# EAGLE design HW4 (EAGLE 9.6.2)
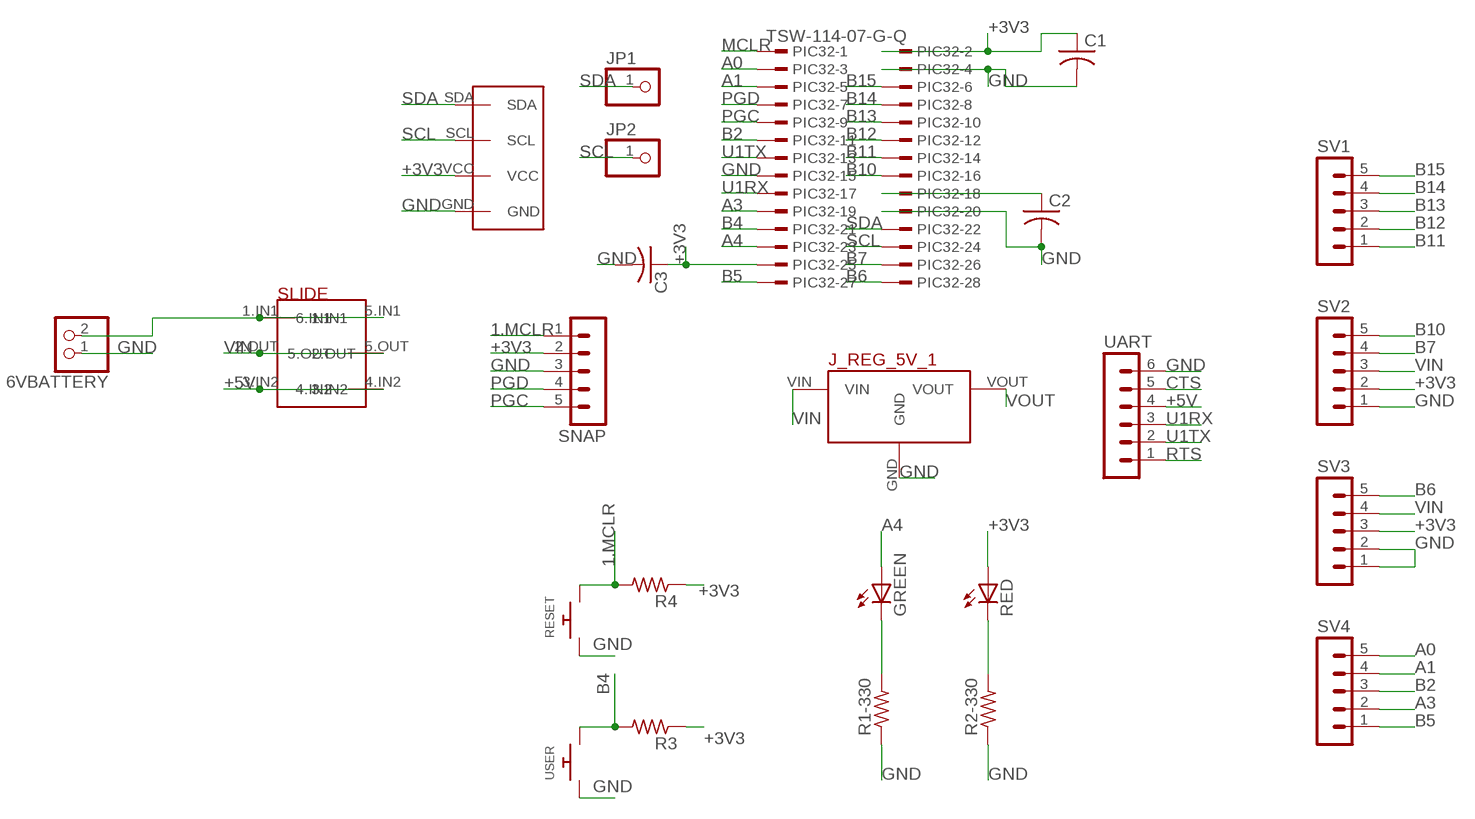
[diagram p0: schematic, sheet 1]

## Parts
6VBATTERY  PINHD-1X2  [1X02]
C1  C-US025-025X050  [C025-025X050]
C2  C-US025-025X050  [C025-025X050]
C3  C-US025-025X050  [C025-025X050]
GREEN  LED3MM  [LED3MM]
J_REG_5V_1  5V_VOLTAGE_REGULATOR  [5V_VOLTAGE_REGULATOR]
JP1  PINHD-1X1  [1X01]
JP2  PINHD-1X1  [1X01]
PIC32  TSW-114-07-G-Q  [TSW-114-XX-G-Q]
R1-330  R-US_0204/7  [0204/7]
R2-330  R-US_0204/7  [0204/7]
R3  R-US_0204/7  [0204/7]
R4  R-US_0204/7  [0204/7]
RED  LED3MM  [LED3MM]
RESET  SWITCH_PUSHBUTTONSOFTTOUCHSMD_SJ  [PUSHBUTTON_SMD_SJ]
SLIDE  SLIDE_DEVICE  [SLIDE_FOOTPRINT]
SNAP  MA05-1  [MA05-1]
SV1  MA05-1  [MA05-1]
SV2  MA05-1  [MA05-1]
SV3  MA05-1  [MA05-1]
SV4  MA05-1  [MA05-1]
U$1  SSD1306_DEVICE  [SSD1306_FOOTPRINT]
UART  MA06-1  [MA06-1]
USER  SWITCH_PUSHBUTTONSOFTTOUCHSMD_SJ  [PUSHBUTTON_SMD_SJ]

## Nets
1.MCLR: R4.2 RESET.P$2 SNAP.1
+3V3: C1.1 C3.1 PIC32.2 PIC32.25 R3.1 R4.1 RED.A SNAP.2 SV2.2 SV3.3 U$1.VCC
+5V: SLIDE.3.IN2 SLIDE.4.IN2 UART.4
A0: PIC32.3 SV4.5
A1: PIC32.5 SV4.4
A3: PIC32.19 SV4.2
A4: GREEN.A PIC32.23
B2: PIC32.11 SV4.3
B4: PIC32.21 R3.2 USER.P$2
B5: PIC32.27 SV4.1
B6: PIC32.28 SV3.5
B7: PIC32.26 SV2.4
B10: PIC32.16 SV2.5
B11: PIC32.14 SV1.1
B12: PIC32.12 SV1.2
B13: PIC32.10 SV1.3
B14: PIC32.8 SV1.4
B15: PIC32.6 SV1.5
CTS: UART.5
GND: 6VBATTERY.1 C1.2 C2.2 C3.2 J_REG_5V_1.GND PIC32.4 PIC32.15 PIC32.20 R1-330.1 R2-330.1 RESET.P$1 SNAP.3 SV2.1 SV3.1 SV3.2 U$1.GND UART.6 USER.P$1
MCLR: PIC32.1
N$1: 6VBATTERY.2 SLIDE.1.IN1 SLIDE.5.IN1(6.IN1)
N$21: GREEN.K(C) R1-330.2
N$22: R2-330.2 RED.K(C)
N$25: C2.1 PIC32.18
PGC: PIC32.9 SNAP.5
PGD: PIC32.7 SNAP.4
RTS: UART.1
SCL: JP2.1 PIC32.24 U$1.SCL
SDA: JP1.1 PIC32.22 U$1.SDA
U1RX: PIC32.17 UART.3
U1TX: PIC32.13 UART.2
VIN: J_REG_5V_1.VIN SLIDE.2.OUT SLIDE.5.OUT SV2.3 SV3.4
VOUT: J_REG_5V_1.VOUT

## Library data of the parts
6VBATTERY = pinhead:PINHD-1X2: PIN HEADER
C1-C3 = adafruit:C-US: CAPACITOR, American symbol
GREEN RED = adafruit:LED: LED OSRAM: - CHIPLED LG R971, LG N971, LY N971, LG Q971, LY Q971, LO R971, LY R971 LH N974, LH R974 LS Q976, LO Q976, LY Q976 LO Q996 - Hyper CHIPLED LW Q18S LB Q993, LB Q99A, LB R99A - SideLED LS A670, LO A670, LY A670, LG A670, LP A670 LB A673, LV A673, LT A673, LW A673 LH A674 LY A675 LS A676, LA A676, LO A676, LY A676, LW A676 LS A679, LY A679, LG A679 - Hyper Micro SIDELED® LS Y876, LA Y876, LO Y876, LY Y876 LT Y87S - SmartLED LW L88C, LW L88S LB L89C, LB L89S, LG L890 LS L89K, LO L89K, LY L89K LS L896, LA L896, LO L896, LY L896 - TOPLED LS T670, LO T670, LY T670, LG T670, LP T670 LSG T670, LSP T670, LSY T670, LOP T670, LYG T670 LG T671, LOG T671, LSG T671 LB T673, LV T673, LT T673, LW T673 LH T674 LS T676, LA T676, LO T676, LY T676, LB T676, LH T676, LSB T676, LW T676 LB T67C, LV T67C, LT T67C, LS T67K, LO T67K, LY T67K, LW E67C LS E67B, LA E67B, LO E67B, LY E67B, LB E67C, LV E67C, LT E67C LW T67C LS T679, LY T679, LG T679 LS T770, LO T770, LY T770, LG T770, LP T770 LB T773, LV T773, LT T773, LW T773 LH T774 LS E675, LA E675, LY E675, LS T675 LS T776, LA T776, LO T776, LY T776, LB T776 LHGB T686 LT T68C, LB T68C - Hyper Mini TOPLED® LB M676 - Mini TOPLED Santana® LG M470 LS M47K, LO M47K, LY M47K Source: http://www.osram.convergy.de/
J_REG_5V_1 = pololu:5V_VOLTAGE_REGULATOR: Polulu 5V Step-Up/Step-Down Voltage REgulator S7V7F5
JP1 JP2 = adafruit:PINHD-1X1: Pin header 1x1 for 0.1" spacing With round pins
PIC32 = con-samtec:TSW-114-*-G: THROUGH-HOLE .025" SQ POST HEADER Source: Samtec TSW.pdf; MF: Samtec Inc.; MPN: TSW-114-07-G-Q
R1-330 R2-330 R3 R4 = adafruit:R-US_: RESISTOR, American symbol
RESET USER = adafruit:SWITCH_PUSHBUTTON: Buttons SOFTTOUCHSMD_SJ - Soft touch temporary push button (Super Junk Akihabara) Compatible with SKPMANE010 [Mouser: 688-SKPMAN] C&K_KSS = Digikey: KSS221GLFS
SLIDE = SLIDE:SLIDE_DEVICE
SNAP SV1-SV4 = con-lstb:MA05-1: PIN HEADER; OC_FARNELL: unknown; OC_NEWARK: unknown
U$1 = SSD1306:SSD1306_DEVICE
UART = con-lstb:MA06-1: PIN HEADER; OC_FARNELL: unknown; OC_NEWARK: unknown

## Board
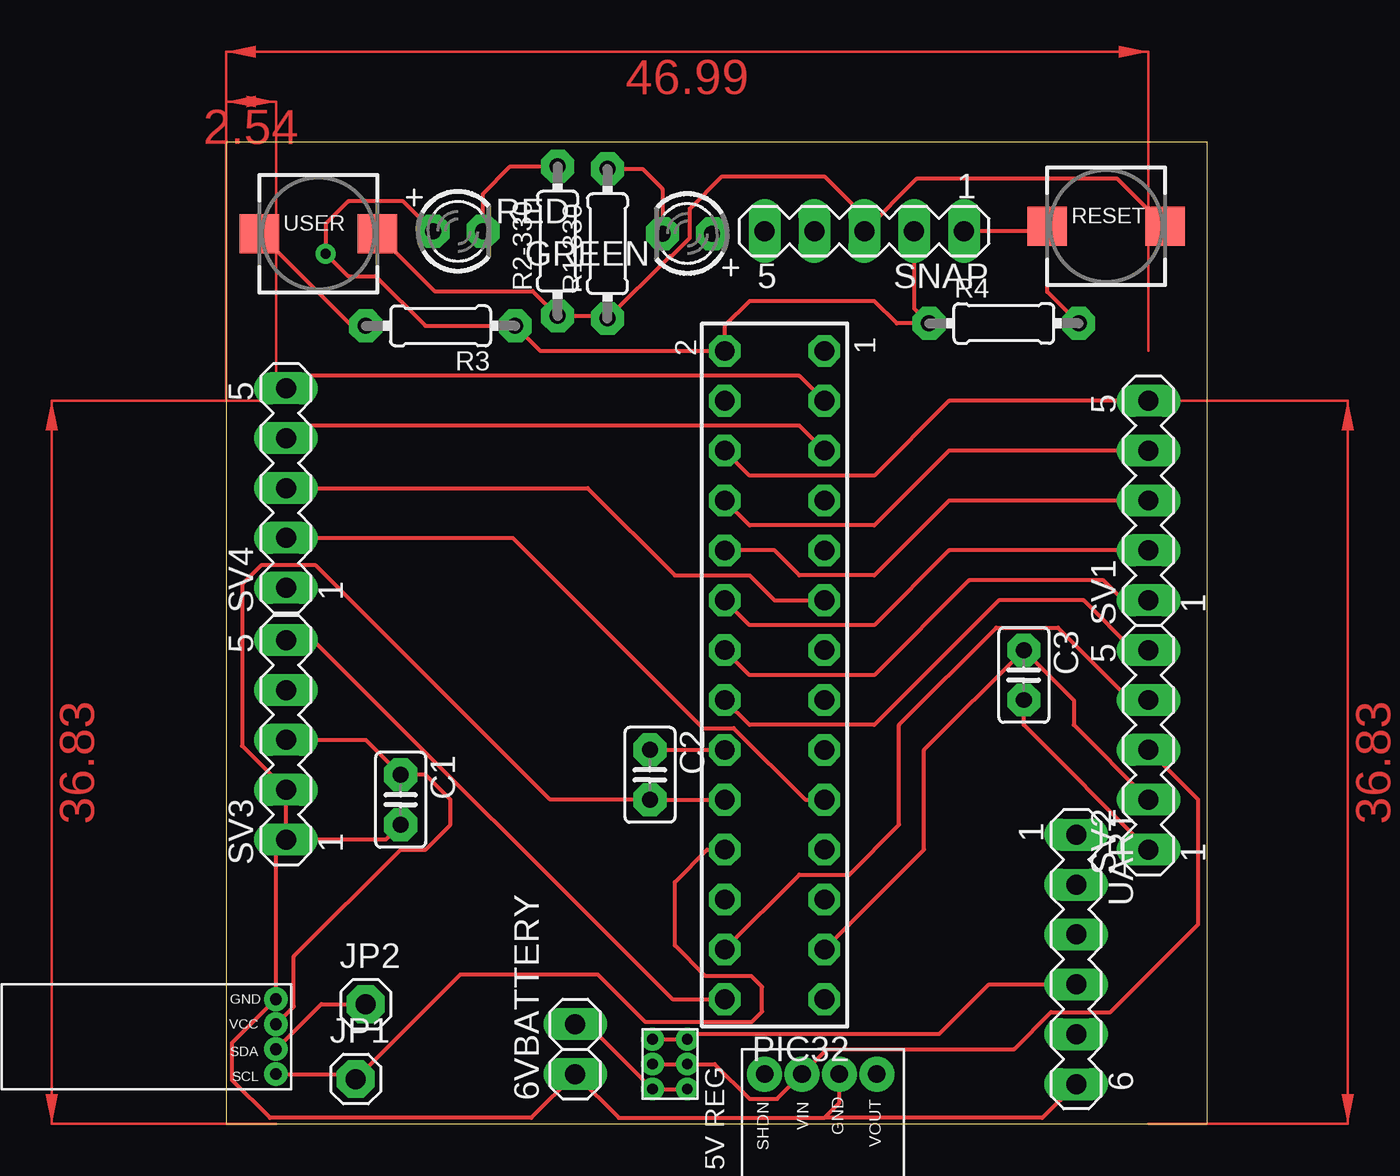
[diagram p1: board, top side]
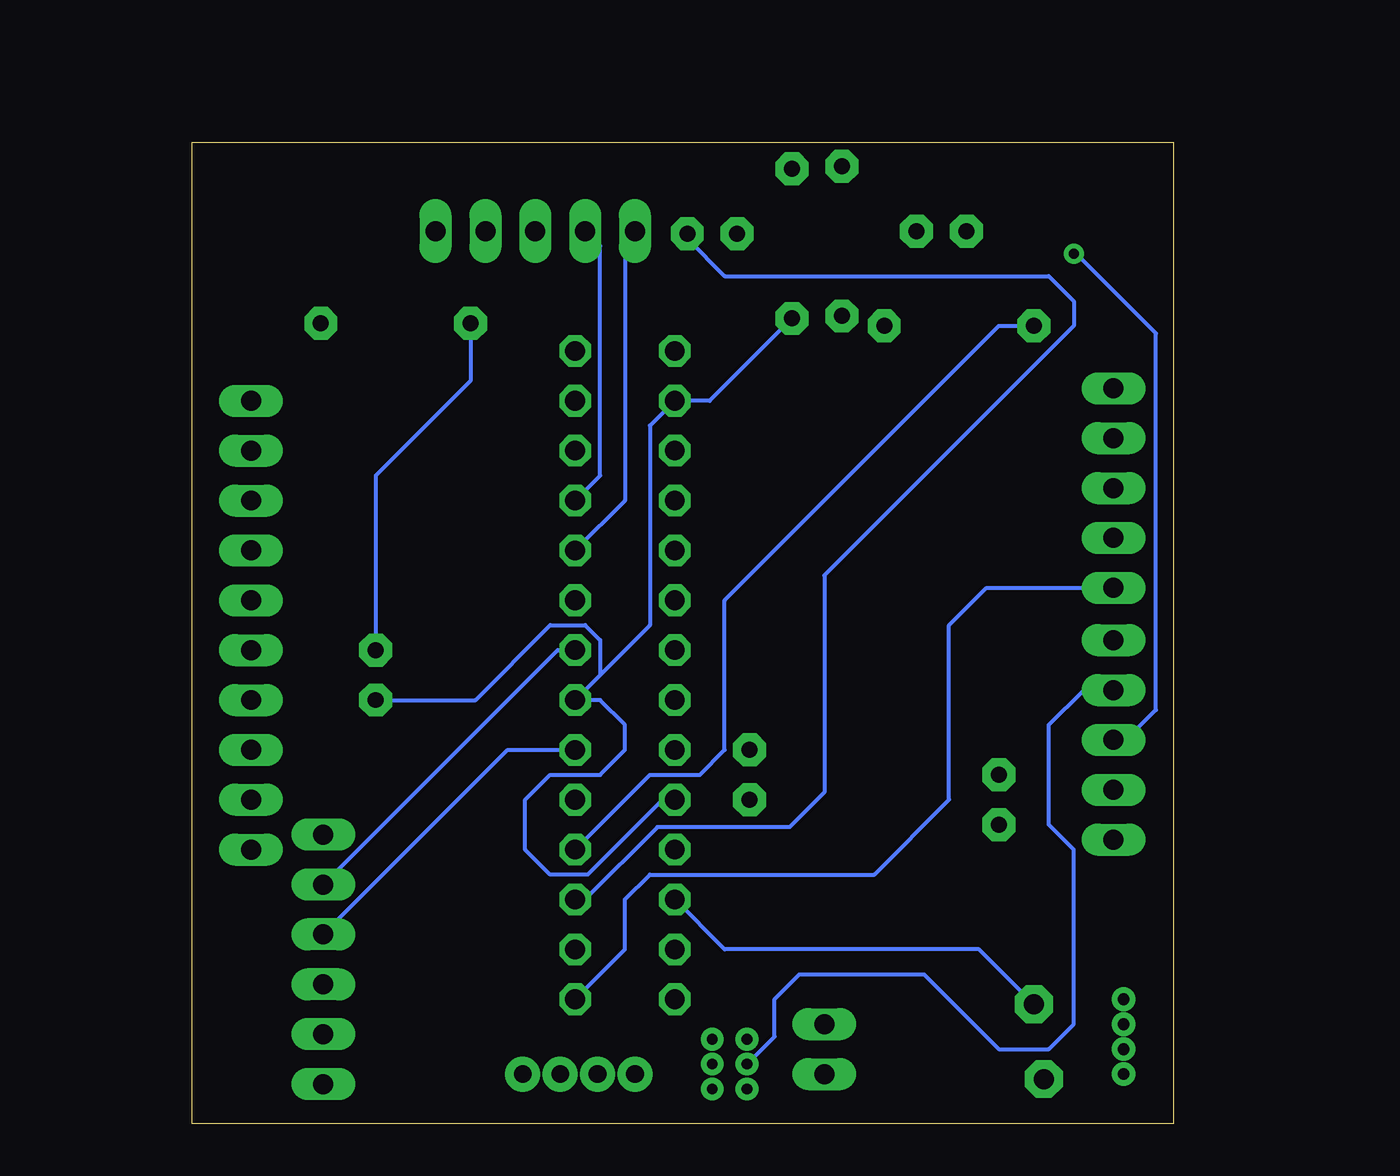
[diagram p2: board, bottom side, seen from below]

Size 50 x 50 mm. Coordinates in mm from the lower left corner, seen from the top.
Outline: 0,0 50,0 50,50 0,50 0,0
Copper layers (1*16): Top 0.035mm / dielectric 1.5mm / Bottom 0.035mm
Design rules "SparkFun": minimum track width 8mil, minimum drill 20mil, track to track 8mil, track to pad 8mil, pad to pad 8mil, via to via 8mil, smd to smd 8mil, copper to edge 8mil, drill to drill 8mil, minimum pad ring 12mil, minimum via ring 10mil, stop-mask expansion 4mil, vias tented up to drill 20mil, thermal gap 10mil

### Footprints (pad centres in the part's own frame; a part is rotated, then mirrored left to right if it is on the bottom)
1X02 = drill 1.016 long: 1 -1.27,0; 2 1.27,0
C025-025X050 = drill 0.813 pad 1.676 octagon: 1 -1.27,0; 2 1.27,0
LED3MM = drill 0.813 pad 1.676 octagon: A -1.27,0; K 1.27,0
5V_VOLTAGE_REGULATOR = drill 0.9 pad 1.778: GND 2.54,-3.048; SHDN 2.54,0.762; VIN 2.54,-1.143; VOUT 2.54,-4.953
1X01 = drill 1.016 pad 1.93 octagon: 1 0,0
TSW-114-XX-G-Q = drill 1 pad 1.5 octagon: 1 16.51,-2.54; 2 16.51,2.54; 3 13.97,-2.54; 4 13.97,2.54; 5 11.43,-2.54; 6 11.43,2.54; 7 8.89,-2.54; 8 8.89,2.54; 9 6.35,-2.54; 10 6.35,2.54; 11 3.81,-2.54; 12 3.81,2.54; 13 1.27,-2.54; 14 1.27,2.54; 15 -1.27,-2.54; 16 -1.27,2.54; 17 -3.81,-2.54; 18 -3.81,2.54; 19 -6.35,-2.54; 20 -6.35,2.54; 21 -8.89,-2.54; 22 -8.89,2.54; 23 -11.43,-2.54; 24 -11.43,2.54; 25 -13.97,-2.54; 26 -13.97,2.54; 27 -16.51,-2.54; 28 -16.51,2.54
0204/7 = drill 0.813 pad 1.676 octagon: 1 -3.81,0; 2 3.81,0
PUSHBUTTON_SMD_SJ = smd 2 x 2: P$1 3,0; P$2 -3,0
SLIDE_FOOTPRINT = drill 0.55 pad 0.813: 1.IN1 -1.27,-2.54; 2.OUT -1.27,-1.27; 3.IN2 -1.27,0; 4.IN2 0.508,0; 5.IN1 0.508,-2.54; 5.OUT 0.508,-1.27
MA05-1 = drill 1.016 long: 1 -5.08,0; 2 -2.54,0; 3 0,0; 4 2.54,0; 5 5.08,0
SSD1306_FOOTPRINT = drill 0.6: GND -2.54,-3.81; SCL -2.54,-1.27; SDA -2.54,0; VCC -2.54,-2.54
MA06-1 = drill 1.016 long: 1 -6.35,0; 2 -3.81,0; 3 -1.27,0; 4 1.27,0; 5 3.81,0; 6 6.35,0

### Placement (x,y rotation side)
6VBATTERY  17.78,3.81 90 top
C1  8.89,16.51 270 top
C2  21.59,17.78 270 top
C3  40.64,22.86 270 top
GREEN  23.5,45.34 180 top
J_REG_5V_1  28.19,0 90 top
JP1  6.6,2.29 0 top
JP2  7.11,6.1 0 top
PIC32  27.94,22.86 90 top
R1-330  19.43,44.83 90 top
R2-330  16.89,44.96 90 top
R3  10.92,40.64 180 top
R4  39.62,40.77 0 top
RED  11.81,45.47 0 top
RESET  44.83,45.72 0 top
SLIDE  22.99,4.32 0 top
SNAP  32.51,45.47 180 top
SV1  46.99,31.75 90 top
SV2  46.99,19.05 90 top
SV3  3.05,19.56 90 top
SV4  3.05,32.38 90 top
U$1  0,2.54 180 top
UART  43.31,8.38 270 top
USER  4.7,45.34 0 top

### Tracks (layer width: path | path; a pad name or v marks a point on that pad's centre or on a via)
1.MCLR
  Top 0.203: R4.2 41.83,42.37 RESET.P$2 41.58,45.47 SNAP.1
+3V3  (via drill 0.51)
  Top 0.203: RED.A 9.02,46.99 6.22,46.99 5.08,45.85 v5.08,44.32 6.22,43.18 7.62,43.18 10.16,40.64 R3.1 16,39.37 PIC32.2 25.4,40.64 26.67,41.91 33.02,41.91 34.16,40.77 R4.1 35.05,41.53 SNAP.2 | U$1.VCC 2.9,5.44 2.92,5.44 3.45,5.97 3.45,8.53 8.89,13.97 10.16,13.97 11.43,15.24 11.43,16.51 10.16,17.78 C1.1 7.11,19.56 SV3.3 | SV2.2 43.18,20.32 43.18,21.59 C3.1 35.56,19.05 35.56,13.97 PIC32.25
  Bottom 0.203: SV3.3 2.41,19.56 0.89,21.08 0.89,40.26 4.95,44.32 v5.08,44.32 | R4.1 35.81,37.85 40.64,33.02 C3.1
+5V
  Top 0.203: SLIDE.3.IN2 SLIDE.4.IN2 23.75,4.57 36.32,4.57 38.86,7.11 UART.4
A0
  Top 0.203: SV4.5 3.68,38.1 29.21,38.1 PIC32.3
A1
  Top 0.203: SV4.4 3.68,35.56 29.21,35.56 PIC32.5
A3
  Top 0.203: SV4.2 14.61,29.84 24.29,20.16 25.86,20.16 29.51,16.51 PIC32.19
A4
  Bottom 0.203: PIC32.23 29.97,11.43 26.29,15.11 19.56,15.11 17.78,16.89 17.78,27.94 5.08,40.64 5.08,41.91 6.35,43.18 22.86,43.18 24.77,45.09 GREEN.A
B2
  Top 0.203: SV4.3 18.41,32.38 22.86,27.94 26.67,27.94 27.94,26.67 PIC32.11
B4
  Top 0.203: USER.P$2 6.4,40.64 R3.2
  Bottom 0.203: PIC32.21 26.67,17.78 24.13,17.78 22.86,19.05 22.86,26.67 8.89,40.64 R3.2
B5
  Bottom 0.203: PIC32.27 27.94,8.89 27.94,11.43 26.67,12.7 15.24,12.7 11.43,16.51 11.43,25.4 9.53,27.3 SV4.1
B6
  Top 0.203: SV3.5 4.45,24.64 22.73,6.35 PIC32.28
B7
  Top 0.203: PIC32.26 29.21,12.7 31.75,12.7 34.29,15.24 34.29,20.32 39.24,25.27 42.38,25.27 46.07,21.59 SV2.4
B10
  Top 0.203: PIC32.16 26.67,20.32 33.02,20.32 39.37,26.67 43.69,26.67 46.23,24.13 SV2.5
B11
  Top 0.203: SV1.1 45.72,26.67 44.7,27.69 37.85,27.69 33.02,22.86 26.67,22.86 PIC32.14
B12
  Top 0.203: SV1.2 36.83,29.21 33.02,25.4 26.67,25.4 PIC32.12
B13
  Top 0.203: SV1.3 36.83,31.75 33.02,27.94 29.21,27.94 27.94,29.21 PIC32.10
B14
  Top 0.203: SV1.4 36.83,34.29 33.02,30.48 26.67,30.48 PIC32.8
B15
  Top 0.203: SV1.5 36.83,36.83 33.02,33.02 26.67,33.02 PIC32.6
GND
  Top 0.203: USER.P$1 10.62,42.42 15.62,42.42 R2-330.1 19.3,41.15 R1-330.1 22.61,44.2 22.7,44.2 23.62,45.12 23.62,46.61 25.27,48.26 30.48,48.26 32.51,46.23 SNAP.3 35.18,48.13 45.42,48.13 RESET.P$1 | SV3.1 2.54,13.97 U$1.GND 2.18,5.99 2.16,5.99 0.3,4.13 0.3,2.23 2.23,0.3 15.54,0.3 6VBATTERY.1 20.02,0.3 30.48,0.3 | SV3.1 SV3.2 0.81,19.25 0.81,27.48 1.78,28.45 4.57,28.45 16.51,16.51 C2.2 PIC32.20 | C1.2 8.13,14.48 SV3.1 | 30.48,0.3 31.24,1.07 J_REG_5V_1.GND | UART.6 41.58,0.3 30.48,0.3 | SV2.1 40.64,20.32 C3.2
  Bottom 0.203: C3.2 35.56,21.59 31.75,25.4 29.97,25.4 29.21,24.64 29.21,22.86 | 29.21,22.86 PIC32.15 29.21,21.59 27.94,20.32 27.94,19.05 29.21,17.78 31.75,17.78 33.02,16.51 33.02,13.97 31.75,12.7 29.84,12.7 26.04,16.51 PIC32.20 | R1-330.1 23.62,36.83 PIC32.4 26.67,35.56 26.67,25.4 29.21,22.86
N$1
  Top 0.203: 6VBATTERY.2 18.41,5.08 SLIDE.1.IN1 SLIDE.5.IN1
N$21
  Top 0.203: R1-330.2 21.21,48.64 22.23,47.62 GREEN.K
N$22
  Top 0.203: RED.K 13.08,47.37 14.48,48.77 R2-330.2
N$25
  Top 0.203: C2.1 PIC32.18
PGC
  Bottom 0.203: SNAP.5 27.94,44.96 27.94,31.75 PIC32.9
PGD
  Bottom 0.203: PIC32.7 29.21,33.02 29.21,44.7 SNAP.4
SCL
  Top 0.203: U$1.SCL 2.9,4.17 2.92,4.17 4.84,6.1 JP2.1
  Bottom 0.203: JP2.1 9.91,8.89 22.86,8.89 PIC32.24
SDA
  Top 0.203: U$1.SDA 6.35,2.54 JP1.1 11.94,7.62 18.92,7.62 21.34,5.21 26.8,5.21 27.3,5.71 27.3,6.99 26.76,7.53 24.43,7.53 22.86,9.1 22.86,12.32 24.51,13.97 PIC32.22
U1RX
  Bottom 0.203: UART.3 33.91,19.05 PIC32.17
U1TX
  Bottom 0.203: UART.2 31.37,24.13 PIC32.13
VIN
  Top 0.203: SLIDE.2.OUT SLIDE.5.OUT 24.89,3.05 26.67,1.27 28.07,1.27 J_REG_5V_1.VIN 30.48,3.68 30.48,3.81 40.15,3.81 42.03,5.69 45.06,5.69 49.53,10.16 49.53,16.51 SV2.3
  Bottom 0.203: SLIDE.2.OUT 20.32,4.45 20.32,6.35 19.05,7.62 12.7,7.62 8.89,3.81 6.35,3.81 5.08,5.08 5.08,13.97 6.35,15.24 6.35,20.32 4.57,22.1 SV3.4
(copper drawn outside any net)
  shapes: Top area x4